# EAGLE design GPduino-T (EAGLE 7.7.0)
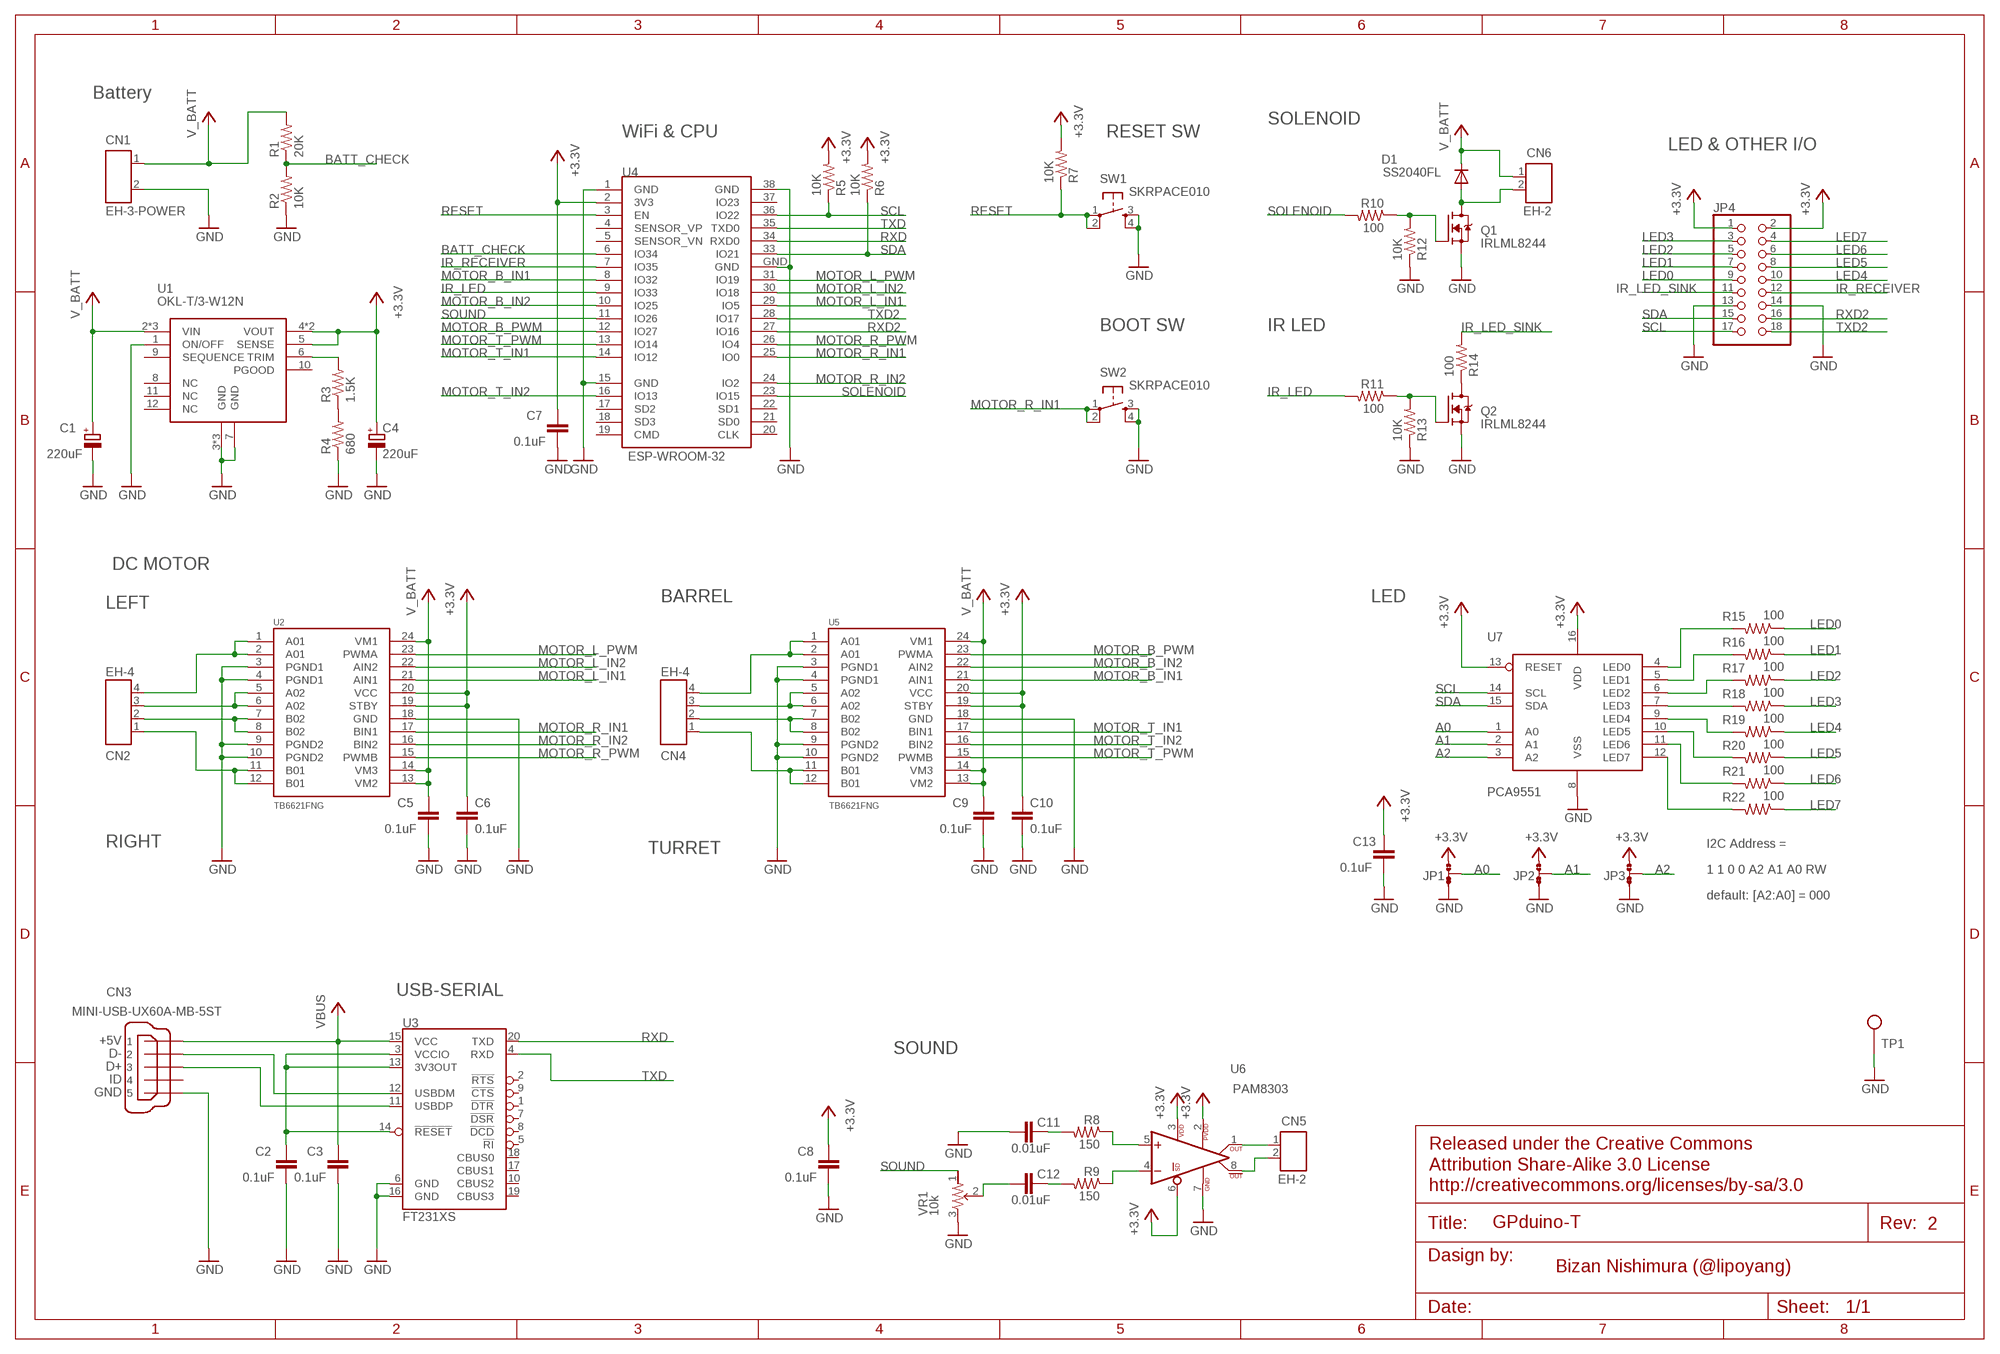
[diagram p0: schematic, sheet 1]

## Parts
C1  220uF  CPOL-EUUD-6,3X7,7  [UD-6,3X7,7_NICHICON]
C2  0.1uF  C-EUC1608  [C1608]
C3  0.1uF  C-EUC1608  [C1608]
C4  220uF  CPOL-EUUD-6,3X7,7  [UD-6,3X7,7_NICHICON]
C5  0.1uF  C-EUC1608  [C1608]
C6  0.1uF  C-EUC1608  [C1608]
C7  0.1uF  C-EUC1608  [C1608]
C8  0.1uF  C-EUC1608  [C1608]
C9  0.1uF  C-EUC1608  [C1608]
C10  0.1uF  C-EUC1608  [C1608]
C11  0.01uF  C-EUC1608  [C1608]
C12  0.01uF  C-EUC1608  [C1608]
C13  0.1uF  C-EUC1608  [C1608]
CN1  EH-3-POWER  [EH-3-POWER]
CN2  EH-4  [EH-4]
CN3  MINI-USB-UX60A-MB-5ST  [UX60A-MB-5ST]
CN4  EH-4  [EH-4]
CN5  EH-2  [EH-2]
CN6  EH-2  [EH-2]
D1  SS2040FL  DIODE-SOD123  [SOD123]
JP1  JUMP-SHORTB  [JUMP-SHORT]
JP2  JUMP-SHORTB  [JUMP-SHORT]
JP3  JUMP-SHORTB  [JUMP-SHORT]
JP4  PINHD-2X9  [2X09]
Q1  IRLML8244  [SOT23]
Q2  IRLML8244  [SOT23]
R1  20K  RESISTOR0603-RES  [0603-RES]
R2  10K  RESISTOR0603-RES  [0603-RES]
R3  1.5K  RESISTOR0603-RES  [0603-RES]
R4  680  RESISTOR0603-RES  [0603-RES]
R5  10K  RESISTOR0603-RES  [0603-RES]
R6  10K  RESISTOR0603-RES  [0603-RES]
R7  10K  RESISTOR0603-RES  [0603-RES]
R8  150  RESISTOR0603-RES  [0603-RES]
R9  150  RESISTOR0603-RES  [0603-RES]
R10  100  RESISTOR0603-RES  [0603-RES]
R11  100  RESISTOR0603-RES  [0603-RES]
R12  10K  RESISTOR0603-RES  [0603-RES]
R13  10K  RESISTOR0603-RES  [0603-RES]
R14  100  RESISTOR0603-RES  [0603-RES]
R15  100  RESISTOR0603-RES  [0603-RES]
R16  100  RESISTOR0603-RES  [0603-RES]
R17  100  RESISTOR0603-RES  [0603-RES]
R18  100  RESISTOR0603-RES  [0603-RES]
R19  100  RESISTOR0603-RES  [0603-RES]
R20  100  RESISTOR0603-RES  [0603-RES]
R21  100  RESISTOR0603-RES  [0603-RES]
R22  100  RESISTOR0603-RES  [0603-RES]
SW1  SKRPACE010  [SKRPACE010]
SW2  SKRPACE010  [SKRPACE010]
TP1  TEST_PIN  [TEST_PIN]
U1  OKL-T/3-W12N  OKL-T/6-W12N  [OKL-T/X-WXXN]
U2  TB6621FNG  [SSOP24]
U3  FT231XS  [SSOP20]
U4  ESP-WROOM-32  [ESP-WROOM-32]
U5  TB6621FNG  [SSOP24]
U6  PAM8303  [MSOP8]
U7  PCA9551  [TSSOP16]
VR1  10k  R-TRIMM  [EVM3Y]

## Nets
+3V3: C4.+ C6.1 C7.1 C8.1 C10.1 C13.1 JP1.1 JP2.1 JP3.1 JP4.1 JP4.2 R5.2 R6.2 R7.2 U1.4(VOUT) U1.4@1(VOUT) U1.5(SENSE) U2.19(STBY) U2.20(VCC) U4.2(3V3) U5.19(STBY) U5.20(VCC) U6.2(PVDD) U6.3(VDD) U6.6(SD) U7.13(RESET) U7.16(VDD) ; supply symbol labelled +3.3V
A0: JP1.2 U7.1(A0)
A01: CN2.4 U2.1(A01) U2.2(A01)
A1: JP2.2 U7.2(A1)
A02: CN2.3 U2.5(A02) U2.6(A02)
A2: JP3.2 U7.3(A2)
A06: CN4.4 U5.1(A01) U5.2(A01)
A07: CN4.3 U5.5(A02) U5.6(A02)
BATT_CHECK: R1.1 R2.2 U4.6(IO34)
GND: C1.- C2.2 C3.2 C4.- C5.2 C6.2 C7.2 C8.2 C9.2 C10.2 C11.2 C13.2 CN1.2 CN3.5 JP1.3 JP2.3 JP3.3 JP4.13 JP4.14 Q1.2(S) Q2.2(S) R2.1 R4.1 R12.1 R13.1 SW1.3 SW1.4 SW2.3 SW2.4 TP1.1 U1.1(ON/OFF) U1.3(GND) U1.3@2(GND) U1.3@3(GND) U1.7(GND) U2.3(PGND1) U2.4(PGND1) U2.9(PGND2) U2.10(PGND2) U2.18(GND) U3.6(GND) U3.16(GND) U4.1(GND) U4.15(GND) U4.38(GND) U4.GND U5.3(PGND1) U5.4(PGND1) U5.9(PGND2) U5.10(PGND2) U5.18(GND) U6.7(GND) U7.8(VSS) VR1.3(A)
IR_LED: R11.2 U4.9(IO33)
IR_LED_SINK: JP4.11 R14.2
IR_RECEIVER: JP4.12 U4.7(IO35)
LED0: JP4.9 R15.1
LED1: JP4.7 R16.1
LED2: JP4.5 R17.1
LED3: JP4.3 R18.1
LED4: JP4.10 R19.1
LED5: JP4.8 R20.1
LED6: JP4.6 R21.1
LED7: JP4.4 R22.1
MOTOR_B_IN1: U4.8(IO32) U5.21(AIN1)
MOTOR_B_IN2: U4.10(IO25) U5.22(AIN2)
MOTOR_B_PWM: U4.12(IO27) U5.23(PWMA)
MOTOR_L_IN1: U2.21(AIN1) U4.29(IO5)
MOTOR_L_IN2: U2.22(AIN2) U4.30(IO18)
MOTOR_L_PWM: U2.23(PWMA) U4.31(IO19)
MOTOR_R_IN1: SW2.1 SW2.2 U2.17(BIN1) U4.25(IO0)
MOTOR_R_IN2: U2.16(BIN2) U4.24(IO2)
MOTOR_R_PWM: U2.15(PWMB) U4.26(IO4)
MOTOR_T_IN1: U4.14(IO12) U5.17(BIN1)
MOTOR_T_IN2: U4.16(IO13) U5.16(BIN2)
MOTOR_T_PWM: U4.13(IO14) U5.15(PWMB)
N$1: CN6.2 D1.A Q1.3(D)
N$2: CN4.1 U5.11(B01) U5.12(B01)
N$3: Q1.1(G) R10.1 R12.2
N$4: CN4.2 U5.7(B02) U5.8(B02)
N$5: CN2.1 U2.11(B01) U2.12(B01)
N$6: CN2.2 U2.7(B02) U2.8(B02)
N$7: Q2.1(G) R11.1 R13.2
N$8: Q2.3(D) R14.1
N$12: R22.2 U7.12(LED7)
N$13: CN3.2 U3.12(USBDM)
N$14: CN3.3 U3.11(USBDP)
N$15: C2.1 U3.3(VCCIO) U3.13(3V3OUT) U3.14(!RESET)
N$16: R21.2 U7.11(LED6)
N$17: R20.2 U7.10(LED5)
N$18: R19.2 U7.9(LED4)
N$19: R18.2 U7.7(LED3)
N$20: R17.2 U7.6(LED2)
N$21: R16.2 U7.5(LED1)
N$22: R15.2 U7.4(LED0)
N$23: R8.1 U6.5(IN+)
N$24: R9.1 U6.4(IN-)
N$25: CN5.1 U6.1(OUT+)
N$26: C11.1 R8.2
N$27: C12.1 R9.2
N$29: CN5.2 U6.8(OUT-)
N$33: C12.2 VR1.2(S)
N$35: R3.1 R4.2
N$36: R3.2 U1.6(TRIM)
RESET: R7.1 SW1.1 SW1.2 U4.3(EN)
RXD: U3.20(TXD) U4.34(RXD0)
RXD2: JP4.16 U4.27(IO16)
SCL: JP4.17 R5.1 U4.36(IO22) U7.14(SCL)
SDA: JP4.15 R6.1 U4.33(IO21) U7.15(SDA)
SOLENOID: R10.2 U4.23(IO15)
SOUND: U4.11(IO26) VR1.1(E)
TXD: U3.4(RXD) U4.35(TXD0)
TXD2: JP4.18 U4.28(IO17)
V_BATT: C1.+ C5.1 C9.1 CN1.1 CN6.1 D1.C R1.2 U1.2(VIN) U1.2@2(VIN) U1.2@3(VIN) U2.13(VM2) U2.14(VM3) U2.24(VM1) U5.13(VM2) U5.14(VM3) U5.24(VM1)
VBUS: C3.1 CN3.1 U3.15(VCC)
Unconnected: CN3.4 U1.8(NC) U1.9(SEQUENCE) U1.10(PGOOD) U1.11(NC) U1.12(NC) U3.1(!DTR) U3.2(!RTS) U3.5(!RI) U3.7(!DSR) U3.8(!DCD) U3.9(!CTS) U3.10(CBUS2) U3.17(CBUS1) U3.18(CBUS0) U3.19(CBUS3) U4.4(SENSOR_VP) U4.5(SENSOR_VN) U4.17(SD2) U4.18(SD3) U4.19(CMD) U4.20(CLK) U4.21(SD0) U4.22(SD1) U4.37(IO23)

## Notes on the sheet
- Battery
- SOLENOID
- WiFi & CPU | RESET SW
- LED & OTHER I/O
- BOOT SW | IR LED
- DC MOTOR
- BARREL | LED
- LEFT
- RIGHT | I2C Address =
- TURRET
- 1 1 0 0 A2 A1 A0 RW
- default: [A2:A0] = 000
- USB-SERIAL
- SOUND
- 2
- Bizan Nishimura (@lipoyang)

## Library data of the parts
C1 C4 = rcl:CPOL-EU: POLARIZED CAPACITOR, European symbol
C2 C3 C5-C13 = resistor:C-EU: CAPACITOR, European symbol
CN1 = lipoyang_mechanical:EH-3-POWER
CN2 CN4 = lipoyang_mechanical:EH-4
CN3 = lipoyang_mechanical:MINI-USB-: MINI USB Connector Source: http://www.hirose.co.jp/cataloge_hp/e24000019.pdf; OC_FARNELL: unknown; OC_NEWARK: unknown
CN5 CN6 = lipoyang_mechanical:EH-2
D1 = diode:DIODE-: DIODE
JP1-JP3 = lipoyang_mechanical:JUMP-SHORT: SMD 0R 0805 Jumper
JP4 = pinhead:PINHD-2X9: PIN HEADER
Q1 Q2 = lipoyang_discrete:IRLML8244: OptiMOS(R)-P Small-Signal-Transistor P-Channel, Enhancement mode, Super Logic Level (2.5 V rated) Source: http://www.infineon.com/upload/Document/BSA223SP_Rev1.3.pdf
R1-R22 = SparkFun:RESISTOR: Resistor Basic schematic elements and footprints for 0603, 1206, and PTH resistors.
SW1 SW2 = lipoyang_mechanical:SKRPACE010
TP1 = lipoyang:TEST_PIN: Test Pin
U1 = lipoyang_ic:OKL-T/6-W12N
U2 U5 = lipoyang_ic:TB6621FNG: Toshiba 1A motor driver
U3 = lipoyang_ic:FT231XS: FTDI FT231X Full Speed USB to Full-handshake UART This USB2.0 Full Speed IC offers a compact bridge to full handshake UART interfaces. The device is a UART, capable of operating up to 3MBaud, with low power consumption (8mA). The FT231X includes the complete FT-X series feature set and enables USB to be added into a system design quickly and easily over a UART interface. See: http://www.ftdichip.com/Products/ICs/FT231X.html
U4 = lipoyang_rf:ESP-WROOM-32: Espressif Systems ESP-WROOM-32
U6 = lipoyang_ic:PAM8303: Ultra-fast precision COMPARATOR
U7 = lipoyang_ic:PCA9551
VR1 = lipoyang_discrete:R-TRIMM: Trimm resistor

## Net classes
0 default: width 0.203 mm
1 vcc: width 0.254 mm

## Board
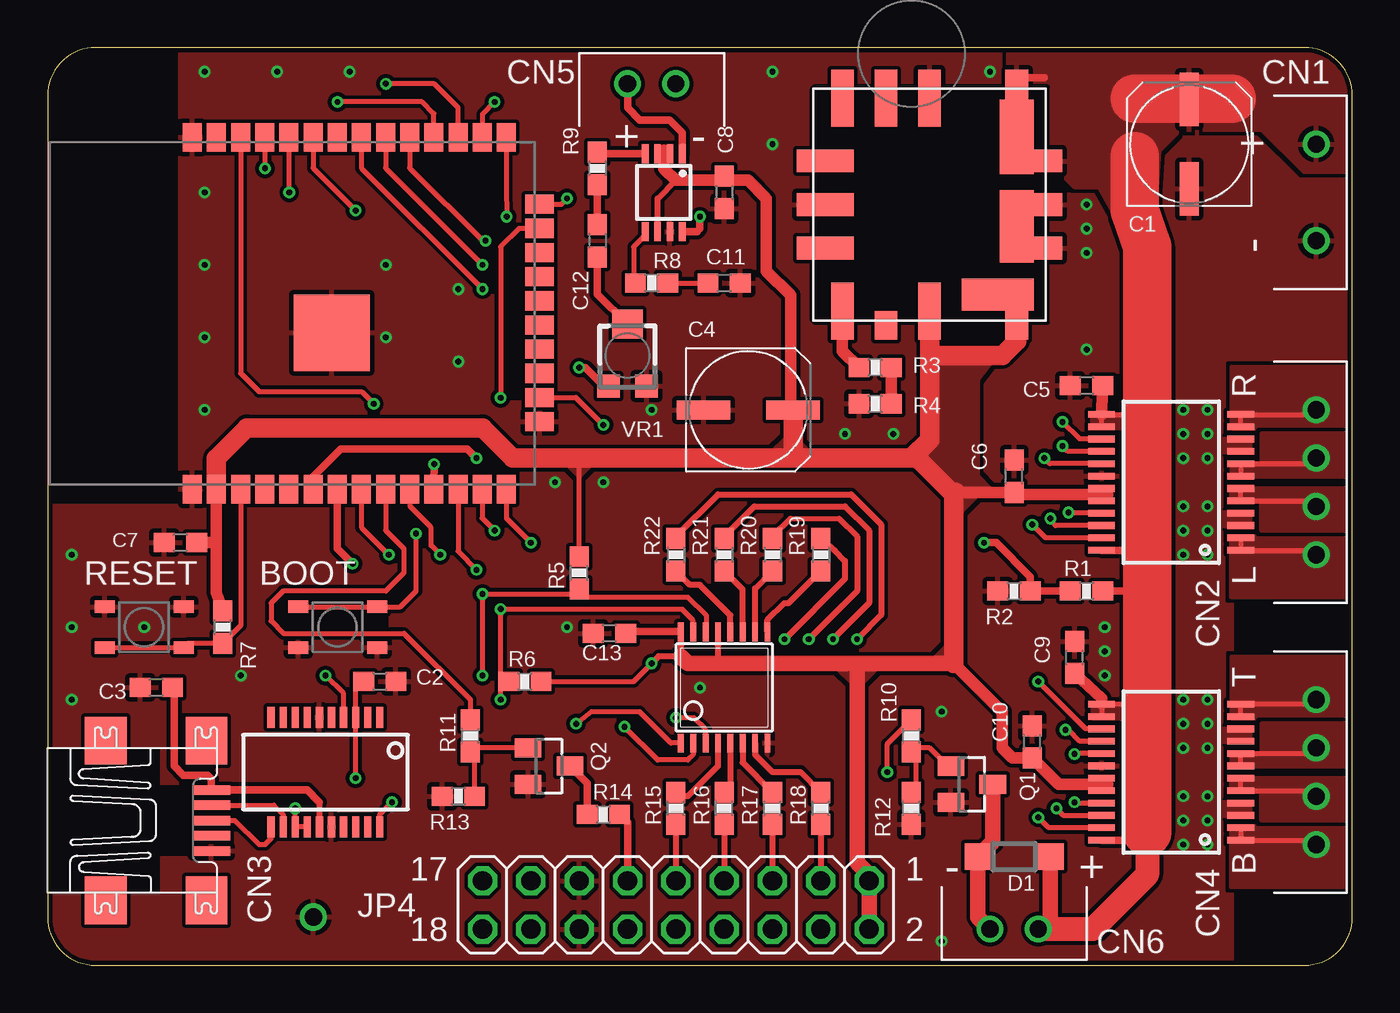
[diagram p1: board, top side]
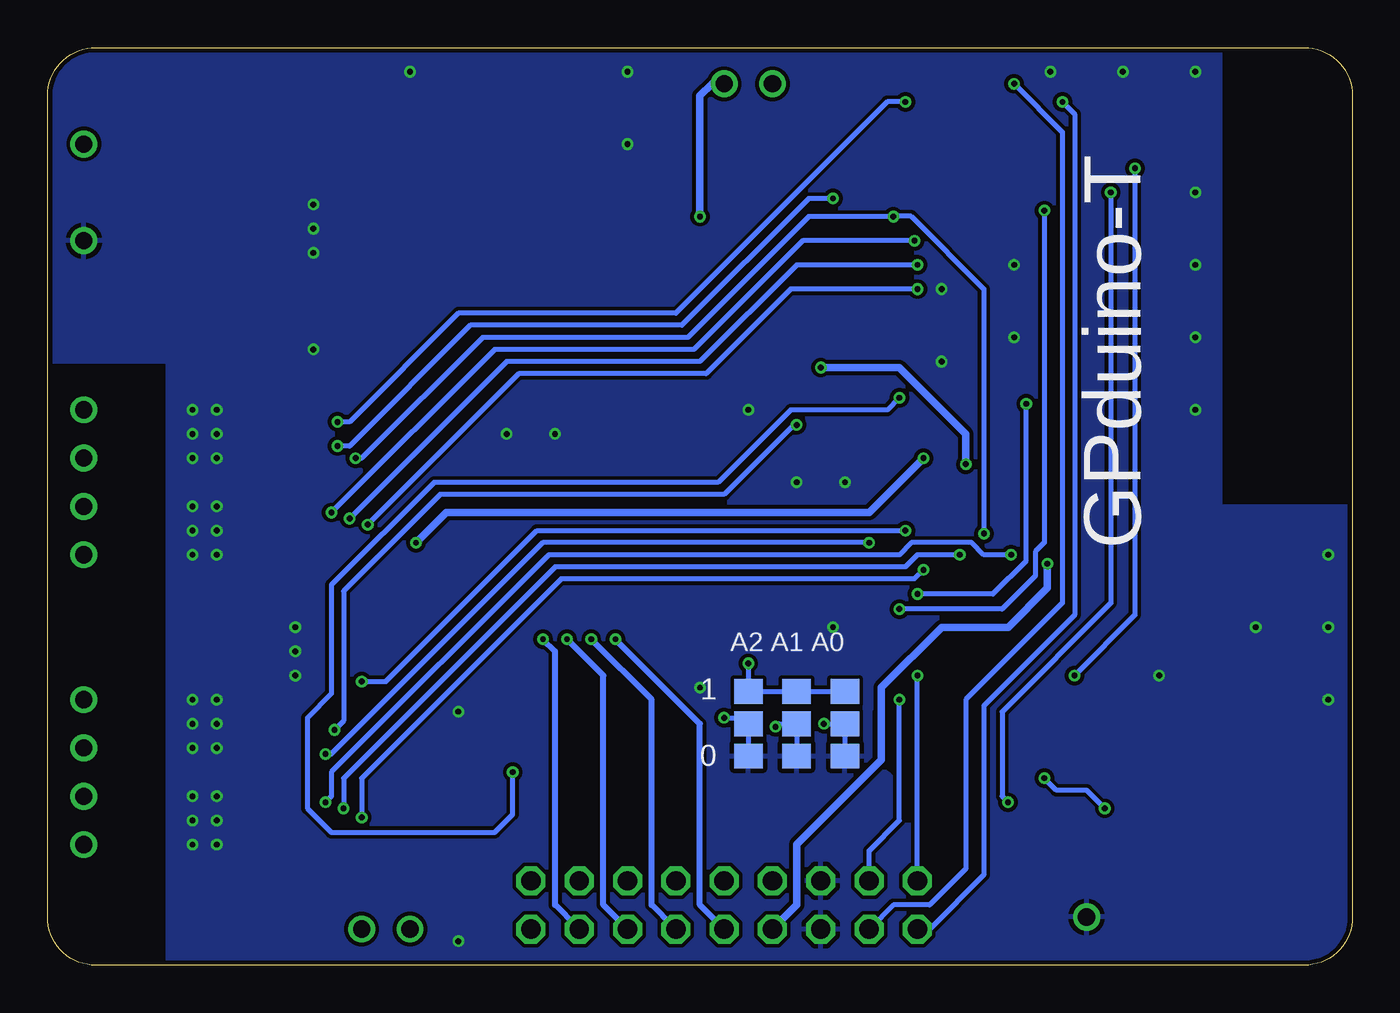
[diagram p2: board, bottom side, seen from below]

Size 68.58 x 48.26 mm. Coordinates in mm from the lower left corner, seen from the top.
Outline: 0,2.54 arc90 2.54,0 66.04,0 arc90 68.58,2.54 68.58,45.72 arc90 66.04,48.26 2.54,48.26 arc90 0,45.72 0,2.54
Copper layers (1*16): Top 0.035mm / dielectric 1.5mm / Bottom 0.035mm
Design rules "SeeedStudio_2layer_DRU_no_angle_20140221_lipoyang": minimum track width 8mil, minimum drill 12mil, track to track 8mil, track to pad 8mil, pad to pad 8mil, via to via 8mil, smd to smd 0mil, copper to edge 10mil, drill to drill 10mil, minimum pad ring 10mil, minimum via ring 6mil, stop-mask expansion 2mil, vias tented up to drill 100mil, thermal gap 10mil

### Footprints (pad centres in the part's own frame; a part is rotated, then mirrored left to right if it is on the bottom)
UD-6,3X7,7_NICHICON = smd 2.8 x 1: + 2.35,0; - -2.35,0
C1608 = smd 1.1 x 1: 1 -0.85,0; 2 0.85,0
EH-3-POWER = drill 0.9: 1 -2.54,0; 2 2.54,0
EH-4 = drill 0.9: 1 -3.81,0; 2 -1.27,0; 3 1.27,0; 4 3.81,0
UX60A-MB-5ST = smd 2 x 0.5: 1 2.25,1.6; 2 2.25,0.8; 3 2.25,0; 4 2.25,-0.8; 5 2.25,-1.6 | smd 2.2 x 2.5: M1 -3.3,-4.2; M2 -3.3,4.2; M3 2,4.2; M4 2,-4.2
EH-2 = drill 0.9: 1 -1.27,0; 2 1.27,0
SOD123 = smd 1.4 x 1.4: A 1.9,0; C -1.9,0
JUMP-SHORT = smd 1.5 x 1.3: 1 0,1.7; 2 0,0; 3 0,-1.7
2X09 = drill 1.016 octagon: 1 -10.16,-1.27; 2 -10.16,1.27; 3 -7.62,-1.27; 4 -7.62,1.27; 5 -5.08,-1.27; 6 -5.08,1.27; 7 -2.54,-1.27; 8 -2.54,1.27; 9 0,-1.27; 10 0,1.27; 11 2.54,-1.27; 12 2.54,1.27; 13 5.08,-1.27; 14 5.08,1.27; 15 7.62,-1.27; 16 7.62,1.27; 17 10.16,-1.27; 18 10.16,1.27
SOT23 = smd 1 x 1.4: 1 -0.95,-1.1; 2 0.95,-1.1; 3 0,1.1
0603-RES = smd 1.1 x 1: 1 -0.85,0; 2 0.85,0
SKRPACE010 = smd 1.05 x 0.65: 1 -2.075,1.075; 2 2.075,1.075; 3 -2.075,-1.075; 4 2.075,-1.075
TEST_PIN = drill 0.914: 1 0,0
OKL-T/X-WXXN = smd 3 x 1.2: 1 -5.6,0; 2 -5.6,4.58; 4 5.6,4.58; 5 5.6,0; 6 5.6,-4.58; 9 -5.6,-4.58; 10 -5.6,-2.29 | smd 1.2 x 3: 2@2 -2.29,5.48; 3 0,5.48; 3@2 2.29,5.48; 7 0,-5.48; 8 -2.29,-5.48; 12 2.29,-5.48 | smd 3.91 x 1.77: 2@3 -3.545,4.58 | smd 3.8 x 1.77: 3@3 1.145,4.58 | smd 1.68 x 3.765: 4@1 4.74,3.583 | smd 1.5 x 1.2: 11 6.35,-2.29
SSOP24 = smd 0.348 x 1.397: 1 -3.575,-3.656; 2 -2.925,-3.656; 3 -2.275,-3.656; 4 -1.625,-3.656; 5 -0.975,-3.656; 6 -0.325,-3.656; 7 0.325,-3.656; 8 0.975,-3.656; 9 1.625,-3.656; 10 2.275,-3.656; 11 2.925,-3.656; 12 3.575,-3.656; 13 3.575,3.656; 14 2.925,3.656; 15 2.275,3.656; 16 1.625,3.656; 17 0.975,3.656; 18 0.325,3.656; 19 -0.325,3.656; 20 -0.975,3.656; 21 -1.625,3.656; 22 -2.275,3.656; 23 -2.925,3.656; 24 -3.575,3.656
SSOP20 = smd 0.381 x 1.093: 1 -2.857,-2.88; 2 -2.223,-2.88; 3 -1.587,-2.88; 4 -0.953,-2.88; 5 -0.318,-2.88; 6 0.318,-2.88; 7 0.953,-2.88; 8 1.587,-2.88; 9 2.223,-2.88; 10 2.857,-2.88; 11 2.857,2.88; 12 2.223,2.88; 13 1.587,2.88; 14 0.953,2.88; 15 0.318,2.88; 16 -0.318,2.88; 17 -0.953,2.88; 18 -1.587,2.88; 19 -2.223,2.88; 20 -2.857,2.88
ESP-WROOM-32 = smd 1.5 x 1: 1 -9.25,7; 2 -9.25,5.73; 3 -9.25,4.46; 4 -9.25,3.19; 5 -9.25,1.92; 6 -9.25,0.65; 7 -9.25,-0.62; 8 -9.25,-1.89; 9 -9.25,-3.16; 10 -9.25,-4.43; 11 -9.25,-5.7; 12 -9.25,-6.97; 13 -9.25,-8.24; 14 -9.25,-9.51; 25 9.25,-9.51; 26 9.25,-8.24; 27 9.25,-6.97; 28 9.25,-5.7; 29 9.25,-4.43; 30 9.25,-3.16; 31 9.25,-1.89; 32 9.25,-0.62; 33 9.25,0.65; 34 9.25,1.92; 35 9.25,3.19; 36 9.25,4.46; 37 9.25,5.73; 38 9.25,7 | smd 1 x 1.5: 15 -5.7,-11.25; 16 -4.43,-11.25; 17 -3.16,-11.25; 18 -1.89,-11.25; 19 -0.62,-11.25; 20 0.65,-11.25; 21 1.92,-11.25; 22 3.19,-11.25; 23 4.46,-11.25; 24 5.73,-11.25 | smd 4 x 4: GND -1.03,-0.34
MSOP8 = smd 0.348 x 1: 1 -0.975,-2.05; 2 -0.325,-2.05; 3 0.325,-2.05; 4 0.975,-2.05; 5 0.975,2.05; 6 0.325,2.05; 7 -0.325,2.05; 8 -0.975,2.05
TSSOP16 = smd 0.305 x 0.991: 1 -2.275,-2.918; 2 -1.625,-2.918; 3 -0.975,-2.918; 4 -0.325,-2.918; 5 0.325,-2.918; 6 0.975,-2.918; 7 1.625,-2.918; 8 2.275,-2.918; 9 2.275,2.918; 10 1.625,2.918; 11 0.975,2.918; 12 0.325,2.918; 13 -0.325,2.918; 14 -0.975,2.918; 15 -1.625,2.918; 16 -2.275,2.918
EVM3Y = smd 1.2 x 1.2: 1 -1,-1.6; 3 1,-1.6 | smd 1.6 x 1.5: 2 0,1.65

### Placement (x,y rotation side)
C1  60.01,43.18 90 top
C2  17.46,14.92 0 top
C3  5.71,14.61 180 top
C4  36.83,29.21 0 top
C5  54.61,30.48 180 top
C6  50.8,25.72 90 top
C7  6.99,22.23 180 top
C8  35.56,40.64 270 top
C9  53.98,16.19 90 top
C10  51.75,11.75 90 top
C11  35.56,35.88 0 top
C12  28.89,38.1 270 top
C13  29.53,17.46 180 top
CN1  66.67,40.64 270 top
CN2  66.67,25.4 270 top
CN3  6.35,7.62 0 top
CN4  66.67,10.16 270 top
CN5  31.75,46.35 0 top
CN6  50.8,1.91 180 top
D1  50.8,5.71 180 top
JP1  26.67,12.7 0 bottom
JP2  29.21,12.7 0 bottom
JP3  31.75,12.7 0 bottom
JP4  33.02,3.17 180 top
Q1  48.58,9.53 270 top
Q2  26.35,10.48 270 top
R1  54.61,19.68 0 top
R2  50.8,19.68 0 top
R3  43.5,31.43 180 top
R4  43.5,29.53 0 top
R5  27.94,20.64 90 top
R6  25.08,14.92 0 top
R7  9.21,17.78 90 top
R8  31.75,35.88 0 top
R9  28.89,41.91 270 top
R10  45.4,12.06 90 top
R11  22.23,12.06 90 top
R12  45.4,8.26 90 top
R13  21.59,8.89 0 top
R14  29.21,7.94 0 top
R15  33.02,8.26 90 top
R16  35.56,8.26 90 top
R17  38.1,8.26 90 top
R18  40.64,8.26 90 top
R19  40.64,21.59 270 top
R20  38.1,21.59 270 top
R21  35.56,21.59 270 top
R22  33.02,21.59 270 top
SW1  5.08,17.78 180 top
SW2  15.24,17.78 0 top
TP1  13.97,2.54 0 top
U1  46.35,40.01 270 top
U2  59.05,25.4 90 top
U3  14.61,10.16 180 top
U4  14.61,34.29 90 top
U5  59.05,10.16 90 top
U6  32.38,40.64 180 top
U7  35.56,14.61 0 top
VR1  30.48,32.07 0 top

### Tracks (layer width: path | path; a pad name or v marks a point on that pad's centre or on a via)
+3V3  (via drill 0.3)
  Top 0.254: U6.3 U6.2 | U2.19 55.24,25.07 55.72,24.77 | 33.24,17.57 U7.16 | 35.23,16.18 34.92,15.88 | 30.48,17.57 C13.1 | 50.9,24.77 C6.1 | 47.73,24.87 47.62,24.77 | R5.2 27.94,26.67 | R6.2 30.8,14.92 v31.75,15.88 | 35.67,41.38 C8.1 | U1.4 50.94,34.47 | 46.67,32.07 46.35,31.11
  Top 0.305: U6.2 32.38,42.86 | 35.34,41.27 C8.1 | U6.6 32.06,40.31 33.02,41.27 | U2.20 U2.19 | U5.19 55.4,9.69 U5.20 | U7.16 33.28,16.25 32.12,16.25 v31.75,15.88 | U7.13 35.23,16.18 | 39.05,29.34 C4.+ | 39.18,26.86 39.37,26.67 | 45.69,26.65 46.01,26.38 45.88,26.51 45.72,26.67
  Top 0.406: 33.24,17.57 30.48,17.57
  Top 0.61: 32.38,42.86 32.39,41.9 33.02,41.27 35.34,41.27 | U4.2 8.88,22.23 | 8.88,22.23 8.88,19.6 R7.2 | C7.1 8.88,22.23 | 55.72,24.77 50.9,24.77 | C6.1 47.73,24.87 | 55.4,9.69 55.72,9.53 53.13,9.52 C10.1 50.7,10.9 50.16,11.43 50.16,13.34 47.62,15.88 | 39.05,29.34 39.05,35.24 37.78,36.51 37.78,40.32 36.83,41.27 35.77,41.27 C8.1 | 50.94,34.47 U1.4@1
  Top 0.813: 33.28,16.25 33.66,15.88 34.92,15.88 42.55,15.88 | JP4.2 JP4.1 43.18,4.76 42.55,5.4 42.55,15.88 | 42.55,15.88 47.62,15.88
  Top 1.016: U4.2 8.88,26.66 10.48,28.26 22.86,28.26 24.45,26.67 27.94,26.67 39.37,26.67 45.4,26.67 | 47.62,24.77 47.62,15.88 | 45.4,26.67 45.72,26.67 | C4.+ 39.18,26.86 | U1.5 46.35,31.11 46.35,27.62 45.4,26.67 | 47.73,24.87 47.52,24.87 45.88,26.51 | U1.4 50.94,32.84 50.16,32.07 46.67,32.07
  Bottom 0.254: JP1.1 JP2.1 JP3.1 v31.75,15.88
  pour Top: 42.55,14.61 43.81,15.88 41.27,15.88
  pour Top: 47.62,15.88 46.35,15.88 47.62,17.14
  pour Top: 46.67,27.62 46.67,25.72 46.35,25.72 45.4,26.67 45.4,26.99 46.04,27.62
  pour Top: 39.05,27.94 37.78,26.67 40.32,26.67
  pour Top: 47.31,24.92 47.31,23.5 47.47,23.34 49.05,24.92
  pour Top: 27.94,25.72 26.67,26.99 29.21,26.99
  pour Top: 49.53,24.77 49.53,25.08 48.9,25.72 48.9,30.8 49.85,32.07 46.35,32.07 46.35,26.35 47.94,24.77
A0  (via drill 0.3)
  Top 0.254: U7.1 32.76,11.69 31.11,13.34 28.57,13.34 v27.78,12.7
  Bottom 0.254: v27.78,12.7 JP1.2
A01
  Top 0.254: U2.2 U2.1 66.44,21.82 CN2.4
  pour Top (rank 2, no thermals): 62.23,22.54 68.26,22.54 68.26,19.37 62.23,19.37
A1  (via drill 0.3)
  Top 0.254: U7.2 33.94,11.07 33.66,10.79 32.07,10.79 v30.32,12.54
  Bottom 0.254: v30.32,12.54 30.16,12.7 JP2.2
A02
  Top 0.254: CN2.3 66.38,24.43 U2.5 U2.6
  pour Top (no thermals): 62.23,25.08 68.26,25.08 68.26,22.86 63.82,22.86 63.82,24.45 62.23,24.45
A2  (via drill 0.3)
  Top 0.254: U7.3 34.59,12.4 33.97,13.02 v33.02,13.02
  Bottom 0.254: v33.02,13.02 32.38,13.02 32.07,12.7 JP3.2
A06
  Top 0.254: U5.2 U5.1 66.44,6.58 CN4.4
  pour Top (rank 2, no thermals): 62.23,7.3 68.26,7.3 68.26,4.13 62.23,4.13
A07
  Top 0.254: CN4.3 66.38,9.19 U5.5 U5.6
  pour Top (no thermals): 62.23,9.84 68.26,9.84 68.26,7.62 63.82,7.62 63.82,9.21 62.23,9.21
BATT_CHECK  (via drill 0.3)
  Top 0.254: U4.6 13.96,25.7
  Top 0.406: R1.1 R2.2 51.65,20.42 49.85,22.23 v49.21,22.23 | 13.96,25.7 15.4,27.15 22.07,27.15 v22.54,26.67
  Bottom 0.406: v22.54,26.67 25.4,23.81 47.62,23.81 v49.21,22.23
GND  (via drill 0.3)
  Top 0.61: U1.3@2 U1.3@3
  other vias: 55.56,16.51 21.59,35.56 59.69,27.94 59.69,29.21 60.96,29.21 59.69,26.67 60.96,26.67 59.69,22.86 60.96,22.86 60.96,24.13 59.69,24.13 59.69,21.59 60.96,21.59 60.96,12.7 59.69,11.43 59.69,13.97 60.96,13.97 59.69,12.7 60.96,11.43 59.69,8.89 60.96,8.89 60.96,7.62 59.69,7.62 59.69,6.35 60.96,6.35 55.56,15.24 55.56,17.78 60.96,27.94 31.75,29.21 21.59,31.75 17.78,33.02 17.78,36.83 8.26,29.21 8.26,33.02 8.26,36.83 8.26,40.64 8.26,46.99 12.06,46.99 15.88,46.99 46.99,1.27 46.99,13.34 5.08,17.78 1.27,17.78 10.16,15.24 27.3,17.78 34.29,14.61 1.27,13.97 1.27,21.59 26.67,25.4 29.21,25.4 54.61,40.01 54.61,38.73 54.61,37.47 41.91,27.94 44.45,27.94 54.61,32.38 49.53,46.99 38.1,46.99 38.1,43.18
  pour Bottom (rank 3): -2.54,24.13 -2.54,-2.54 62.23,-2.54 62.23,31.75 71.12,31.75 71.12,50.8 6.99,50.8 6.99,24.13
  pour Top (rank 3): -1.27,24.13 -1.27,-1.27 62.23,-1.27 62.23,31.75 69.85,31.75 69.85,49.53 6.99,49.53 6.99,24.13
  pour Top (no thermals): 60.96,27.62 63.18,27.62 63.18,26.99 60.96,26.99
  pour Top (rank 2, no thermals): 60.96,23.81 63.18,23.81 63.18,23.18 60.96,23.18
  pour Top (no thermals): 60.96,12.38 63.18,12.38 63.18,11.75 60.96,11.75
  pour Top (no thermals): 60.96,8.57 63.18,8.57 63.18,7.94 60.96,7.94
IR_LED
  Top 0.254: U4.9 17.77,22.88 18.73,21.91 18.73,20.64 17.78,19.68 12.38,19.68 11.75,19.05 11.75,18.1 12.38,17.46 18.73,17.46 22.23,13.97 R11.2
IR_LED_SINK
  Top 0.406: JP4.11 30.48,7.52 R14.2
IR_RECEIVER  (via drill 0.3)
  Top 0.406: U4.7 15.22,21.92 v16.03,21.11
  Bottom 0.254: JP4.12 30.35,2.03
  Bottom 0.406: 30.35,2.03 29.21,3.17 29.21,6.35 24.77,10.79 24.77,14.61 21.59,17.78 18.1,17.78 16.03,19.84 v16.03,21.11
LED0
  Top 0.305: R15.1 JP4.9
LED1
  Top 0.305: R16.1 JP4.7
LED2
  Top 0.305: R17.1 JP4.5
LED3
  Top 0.305: R18.1 JP4.3
LED4  (via drill 0.3)
  Top 0.305: R19.1 41.38,21.8 41.91,21.27 41.91,20.32 v38.73,17.14
  Bottom 0.254: JP4.10 33.15,2.03
  Bottom 0.305: 33.15,2.03 34.29,3.17 34.29,12.7 v38.73,17.14
LED5  (via drill 0.3)
  Top 0.254: R20.1 38.1,22.54 | 39.05,23.5 41.59,23.5
  Top 0.305: 38.1,22.54 39.05,23.5 | 41.59,23.5 42.55,22.54 42.55,19.68 v40.01,17.14
  Bottom 0.254: JP4.8 35.69,2.03
  Bottom 0.305: 35.69,2.03 36.83,3.17 36.83,13.97 v40.01,17.14
LED6  (via drill 0.3)
  Top 0.254: R21.1 35.56,22.54
  Top 0.305: 35.56,22.54 37.15,24.13 41.91,24.13 43.18,22.86 43.18,19.05 v41.27,17.14
  Bottom 0.254: JP4.6 38.23,2.03
  Bottom 0.305: 38.23,2.03 39.37,3.17 39.37,15.24 v41.27,17.14
LED7  (via drill 0.3)
  Top 0.254: R22.1 33.02,22.54
  Top 0.305: 33.02,22.54 35.24,24.77 42.23,24.77 43.81,23.18 43.81,18.41 v42.55,17.14
  Bottom 0.254: JP4.4 40.77,2.03
  Bottom 0.305: 40.77,2.03 41.91,3.17 41.91,16.51 v42.55,17.14
MOTOR_B_IN1  (via drill 0.3)
  Top 0.254: U4.8 16.5,23.03 v17.94,21.59 | v53.98,8.57 54.01,8.54 U5.21
  Bottom 0.254: v17.94,21.59 19.37,21.59 20,22.23 23.18,22.23 23.81,21.59 42.23,21.59 53.66,10.16 53.66,8.89 v53.98,8.57
MOTOR_B_IN2  (via drill 0.3)
  Top 0.254: v20.64,21.59 20.16,22.07 20.16,23.02 19.05,24.13 19.05,25.02 U4.10 | v53.02,8.26 53.39,7.88 U5.22
  Bottom 0.254: v20.64,21.59 22.86,21.59 23.5,20.95 41.91,20.95 53.02,9.84 v53.02,8.26
MOTOR_B_PWM  (via drill 0.3)
  Top 0.254: U5.23 52.61,7.24 v52.07,7.78 | U4.12 21.57,21.76 v22.54,20.8
  Bottom 0.254: v22.54,20.8 23.02,20.32 41.59,20.32 52.07,9.84 v52.07,7.78
MOTOR_L_IN1  (via drill 0.3)
  Top 0.254: U4.29 19.04,41.92 22.86,38.1 v23.02,38.1 | U2.21 53.7,23.77 v53.66,23.81
  Bottom 0.254: v23.02,38.1 28.89,38.1 34.61,32.38 45.09,32.38 v53.66,23.81
MOTOR_L_IN2  (via drill 0.3)
  Top 0.254: U4.30 17.77,41.92 v22.86,36.83 | U2.22 52.97,23.12 v52.7,23.5
  Bottom 0.254: v22.86,36.83 29.21,36.83 34.29,31.75 44.45,31.75 v52.7,23.5
MOTOR_L_PWM  (via drill 0.3)
  Top 0.254: U4.31 16.5,41.92 v22.86,35.56 | U2.23 52.45,22.48 v51.75,23.18
  Bottom 0.254: v22.86,35.56 29.53,35.56 33.97,31.11 43.81,31.11 v51.75,23.18
MOTOR_R_IN1  (via drill 0.3)
  Top 0.254: U4.25 24.11,40.97 v24.13,39.37 | SW2.1 SW2.2 18.54,18.86 19.37,19.68 v19.37,22.7 | U2.17 52.68,26.38 v52.39,26.67
  Bottom 0.254: v52.39,26.67 52.07,26.67 45.72,33.02 34.92,33.02 28.57,39.37 v24.13,39.37 24.11,39.38 23.19,39.38 19.37,35.56 v19.37,22.7
MOTOR_R_IN2  (via drill 0.3)
  Top 0.254: 25.86,39.83 U4.24 27,40.02 v27.3,40.32 | U2.16 53.62,27.02 v53.34,27.3
  Bottom 0.254: v27.3,40.32 28.57,40.32 35.24,33.66 46.35,33.66 52.7,27.3 v53.34,27.3
MOTOR_R_PWM  (via drill 0.3)
  Top 0.254: U4.26 22.84,43.8 22.86,44.77 v23.5,45.4 | U2.15 54.24,27.68 v53.34,28.57
  Bottom 0.254: v23.5,45.4 24.45,45.4 35.56,34.29 46.99,34.29 52.7,28.57 v53.34,28.57
MOTOR_T_IN1  (via drill 0.3)
  Top 0.254: U4.14 24.11,23.51 v25.4,22.23 | U5.17 53.95,11.13 v53.98,11.11
  Bottom 0.254: v25.4,22.23 42.55,22.23 53.66,11.11 v53.98,11.11
MOTOR_T_IN2  (via drill 0.3)
  Top 0.254: U4.16 27.77,29.86 v29.21,28.42 | U5.16 54.26,11.79 53.66,12.38 v53.5,12.38
  Bottom 0.254: v29.21,28.42 29.37,28.42 29.69,28.1 33.02,24.77 47.94,24.77 53.02,19.68 53.02,12.86 v53.5,12.38
MOTOR_T_PWM  (via drill 0.3)
  Top 0.254: U4.13 22.84,23.51 v23.5,22.86 | U5.15 54.56,12.44 v52.07,14.92
  Bottom 0.254: v23.5,22.86 42.86,22.86 50.8,14.92 v52.07,14.92
N$1
  Top 0.813: CN6.2 48.9,2.54 D1.A 49.68,6.49 Q1.3
N$2
  Top 0.254: U5.11 U5.12 66.44,13.73 CN4.1
  pour Top (rank 2, no thermals): 62.23,13.02 68.26,13.02 68.26,16.19 62.23,16.19
N$3
  Top 0.254: R12.2 45.62,9.32 45.62,11 R10.1 45.62,11.43 46.35,11.43 47.31,10.47 Q1.1
N$4
  Top 0.254: U5.7 U5.8 66.38,11.13 CN4.2
  pour Top (no thermals): 62.23,10.48 68.26,10.48 68.26,12.7 63.82,12.7 63.82,11.11 62.23,11.11
N$5
  Top 0.254: U2.11 U2.12 66.44,28.98 CN2.1
  pour Top (rank 2, no thermals): 62.23,28.26 68.58,28.26 68.58,31.43 62.23,31.43
N$6
  Top 0.254: CN2.2 66.38,26.38 U2.8 U2.7
  pour Top (no thermals): 62.23,25.72 68.26,25.72 68.26,27.94 63.82,27.94 63.82,26.35 62.23,26.35
N$7
  Top 0.254: 22.61,9.06 R13.2 22.44,11 R11.1 22.23,11.43 Q2.1
N$8
  Top 0.406: R14.1 28.36,9.57 Q2.3
N$9
  cutout Bottom: 46.99,34.29 53.34,27.94 53.34,27.62 51.75,26.04 51.44,26.04 45.09,32.38
N$10
  cutout Bottom: 33.02,25.4 33.02,23.81 34.29,23.81 34.29,25.4
N$11
  cutout Bottom: 20.32,19.05 21.59,19.05 21.59,17.78 20.32,17.78
N$12
  Top 0.305: U7.12 35.88,18.41 34.29,20 33.76,20 R22.2
N$13
  Top 0.254: CN3.2 11.9,8.42 12.38,7.94 U3.12
N$14
  Top 0.254: CN3.3 9.84,7.62 11.11,6.35 11.43,6.35 11.75,6.67 U3.11
N$15  (via drill 0.3)
  Top 0.254: C2.1 16.19,14.5 U3.3 v16.19,9.84 | v13.02,8.26 U3.13 U3.14
  Bottom 0.254: v13.02,8.26 13.97,9.21 15.56,9.21 v16.19,9.84
N$16
  Top 0.305: U7.11 36.53,19.77 R21.2
N$17
  Top 0.305: U7.10 37.19,19.82 R20.2
N$18
  Top 0.305: U7.9 37.84,18.15 38.73,19.05 38.95,19.05 R19.2
N$19
  Top 0.305: U7.7 37.19,11.07 38.1,10.16 39.59,10.16 R18.2
N$20
  Top 0.305: U7.6 36.53,10.67 R17.2
N$21
  Top 0.254: 35.88,9.43 R16.2
  Top 0.305: U7.5 35.88,9.43
N$22
  Top 0.254: 33.23,8.89 R15.2
  Top 0.305: U7.4 35.23,10.47 33.66,8.89 33.23,8.89
N$23
  Top 0.254: U6.5 31.41,38.4 30.8,37.78 30.8,36.3 R8.1
N$24
  Top 0.254: 28.96,42.69 R9.1
  Top 0.406: U6.4 28.96,42.69
N$25
  Top 0.406: U6.1 33.36,43.79 32.7,44.45 31.11,44.45 30.48,45.09 CN5.1
N$26
  Top 0.254: R8.2 C11.1
N$27
  Top 0.406: R9.2 C12.1
N$28
  cutout Bottom: 23.18,38.1 23.18,35.56 29.21,35.56 29.21,38.1
N$29  (via drill 0.3)
  Top 0.406: U6.8 34.15,38.59 34.29,38.73 v34.29,39.37
  Bottom 0.406: CN5.2 33.66,46.35 34.29,45.72 v34.29,39.37
N$30
  cutout Bottom: 22.86,7.62 23.81,7.62 23.81,9.84 24.13,10.16 25.08,10.79 25.08,13.34 22.86,13.34
N$31
  cutout Top: 23.81,29.84 25.08,29.84 25.08,31.11 23.81,31.11
N$32
  cutout Top: 17.78,19.05 17.78,17.14 16.51,17.14 16.51,19.05
N$33
  Top 0.406: C12.2 28.89,35.3 VR1.2
N$34
  cutout Top: 40.16,46.04 40.16,33.97 40.32,33.81 52.55,33.81 52.55,46.2 40.32,46.2
N$35
  Top 0.61: R3.1 R4.2
N$36
  Top 0.61: U1.6 41.77,32.3 R3.2
RESET
  Top 0.254: SW1.2 SW1.1 7.38,16.93 R7.1 10.14,17.87 U4.3
RXD  (via drill 0.3)
  Top 0.254: U4.34 12.69,40.97 v12.7,40.64 | U3.20 17.46,7.94 v18.1,8.57
  Bottom 0.254: v12.7,40.64 12.7,19.05 18.41,13.34 18.41,8.89 v18.1,8.57
RXD2  (via drill 0.3)
  Top 0.254: U4.27 21.57,45.1 20.32,46.35 v17.78,46.35
  Bottom 0.254: v17.78,46.35 15.24,43.81 15.24,19.05 20.32,13.97 20.32,5.08 22.23,3.17 24.13,3.17 JP4.16
SCL  (via drill 0.3)
  Top 0.254: 27.94,19.37 27.46,19.53 v22.86,19.53 v22.86,15.24 | 27.94,19.37 33.66,19.37 34.61,18.41 34.61,17.55 U7.14 | U4.36 10.14,31.13 11.11,30.16 16.51,30.16 v17.14,29.53 | R5.1 27.94,19.37
  Bottom 0.254: v22.86,19.53 18.89,19.53 17.14,21.27 v17.14,29.53 | JP4.17 v22.86,15.24
SDA  (via drill 0.3)
  Top 0.254: U7.15 33.94,18.14 33.34,18.73 v23.81,18.73 23.81,14.92 | U4.33 13.96,41.92 v16.19,39.69 | v23.81,13.97 23.81,14.92 | R6.1 23.81,14.92
  Bottom 0.254: v16.19,39.69 16.19,22.23 16.67,21.75 16.67,20.48 18.41,18.73 v23.81,18.73 | JP4.15 25.4,6.03 23.81,7.62 v23.81,13.97
SOLENOID  (via drill 0.3)
  Top 0.254: U4.23 24.78,38.75 23.81,37.78 v23.81,29.84 | v44.13,10.16 44.13,11.64 R10.2
  Bottom 0.254: v23.81,29.84 24.45,29.21 29.53,29.21 33.34,25.4 48.26,25.4 53.66,20 53.66,14.29 54.93,13.02 54.93,8.26 53.66,6.99 45.09,6.99 44.13,7.94 v44.13,10.16
SOUND  (via drill 0.3)
  Top 0.254: U4.11 20.3,25.39
  Top 0.406: 20.3,25.39 v20.32,26.35 | VR1.1 29.22,30.47 28.26,31.43 v27.94,31.43
  Bottom 0.406: v20.32,26.35 20.32,27.94 23.81,31.43 v27.94,31.43
TXD  (via drill 0.3)
  Top 0.254: U3.4 15.56,14.29 v14.61,15.24 | v11.43,41.91 11.43,43.52 U4.35
  Bottom 0.254: v11.43,41.91 11.43,18.41 v14.61,15.24
TXD2  (via drill 0.3)
  Top 0.254: U4.28 20.3,44.78 19.68,45.4 v15.24,45.4
  Bottom 0.254: v15.24,45.4 14.61,44.77 14.61,18.41 19.37,13.65 19.37,4.76 22.23,1.91 JP4.18
V_BATT
  Top 0.254: 56.75,6.58 57.78,6.99 | U5.14 U5.13 56.91,13.73 57.78,13.97 | U2.14 U2.13 56.91,28.98 57.78,30.8 | 56.75,21.82 57.78,22.23 | 52.7,2.54 CN6.1 | 60.2,45.72 C1.+ | 59.93,45.6 C1.+ | U1.2 51.25,46.54 51.12,46.67 | 60.33,46.67 60.33,45.85 C1.+
  Top 0.406: U5.24 56.75,6.58 | U2.24 56.75,21.82 | R1.2 57.78,19.68 | 51.12,46.67 52.39,46.67
  Top 0.61: U2.13 55.4,29.27 C5.1 | U5.13 55.4,14.03 C9.1 | U1.2 U1.2@3 | 56.9,42.3 57.15,42.55
  Top 0.813: D1.C 52.7,2.54
  Top 1.27: 57.78,6.99 57.78,4.76 54.93,1.91 CN6.1
  Top 2.54: 57.78,6.99 57.78,13.97 57.78,19.68 57.78,22.23 57.78,30.8 57.78,37.78 57.15,39.69 57.15,42.55 | 57.15,45.56 62.23,45.56
  pour Top (no thermals): 54.93,28.89 56.83,28.89 56.83,28.26 54.93,28.26
  pour Top (no thermals): 54.93,13.65 54.93,13.02 57.15,13.02 57.15,13.65
  pour Top: 50.48,48.42 50.48,41.75 53.34,41.59 53.98,40.96 55.24,40.96 56.04,39.53 58.26,40.48 58.42,42.86 59.53,43.97 63.82,43.97 66.04,41.75 68.58,41.75 68.58,48.26 50.64,48.26
VBUS
  Top 0.254: 6.67,14.5 C3.1
  Top 0.305: 14.29,8.57 U3.15
  Top 0.406: 6.67,14.5 6.67,10.48 7.14,10 8.41,10 8.6,9.81 CN3.1 13.64,9.22 14.29,8.57

### Text on the board
tPlace: + | - | + | - | R | RESET | BOOT | L | T | - | + | B | 17 | 1 | 18 | 2
bPlace: GPduino-T | A2 A1 A0 | 1 | 0